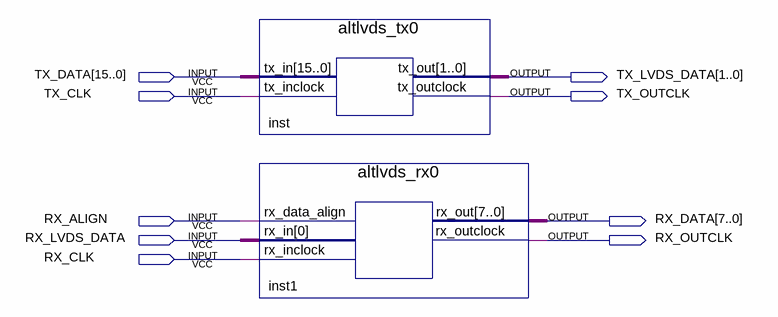
[diagram p0: schematic sheet]
// Quartus schematic lvds_tranceivers.bdf as structural Verilog: 2 symbols, 9 pins
module lvds_tranceivers (
  input  [15:0] TX_DATA,
  input  TX_CLK,
  input  RX_ALIGN,
  input  RX_LVDS_DATA,
  input  RX_CLK,
  output [1:0] TX_LVDS_DATA,
  output TX_OUTCLK,
  output [7:0] RX_DATA,
  output RX_OUTCLK
);

  altlvds_tx0 inst (.tx_in(TX_DATA), .tx_inclock(TX_CLK), .tx_out(TX_LVDS_DATA), .tx_outclock(TX_OUTCLK));
  altlvds_rx0 inst1 (
    .rx_data_align(RX_ALIGN), .rx_in(RX_LVDS_DATA), .rx_inclock(RX_CLK), .rx_out(RX_DATA),
    .rx_outclock(RX_OUTCLK));
endmodule
